# Altium project FMC_DAC_125M_14B_16CHA.PrjPCB (part 1 of 4)
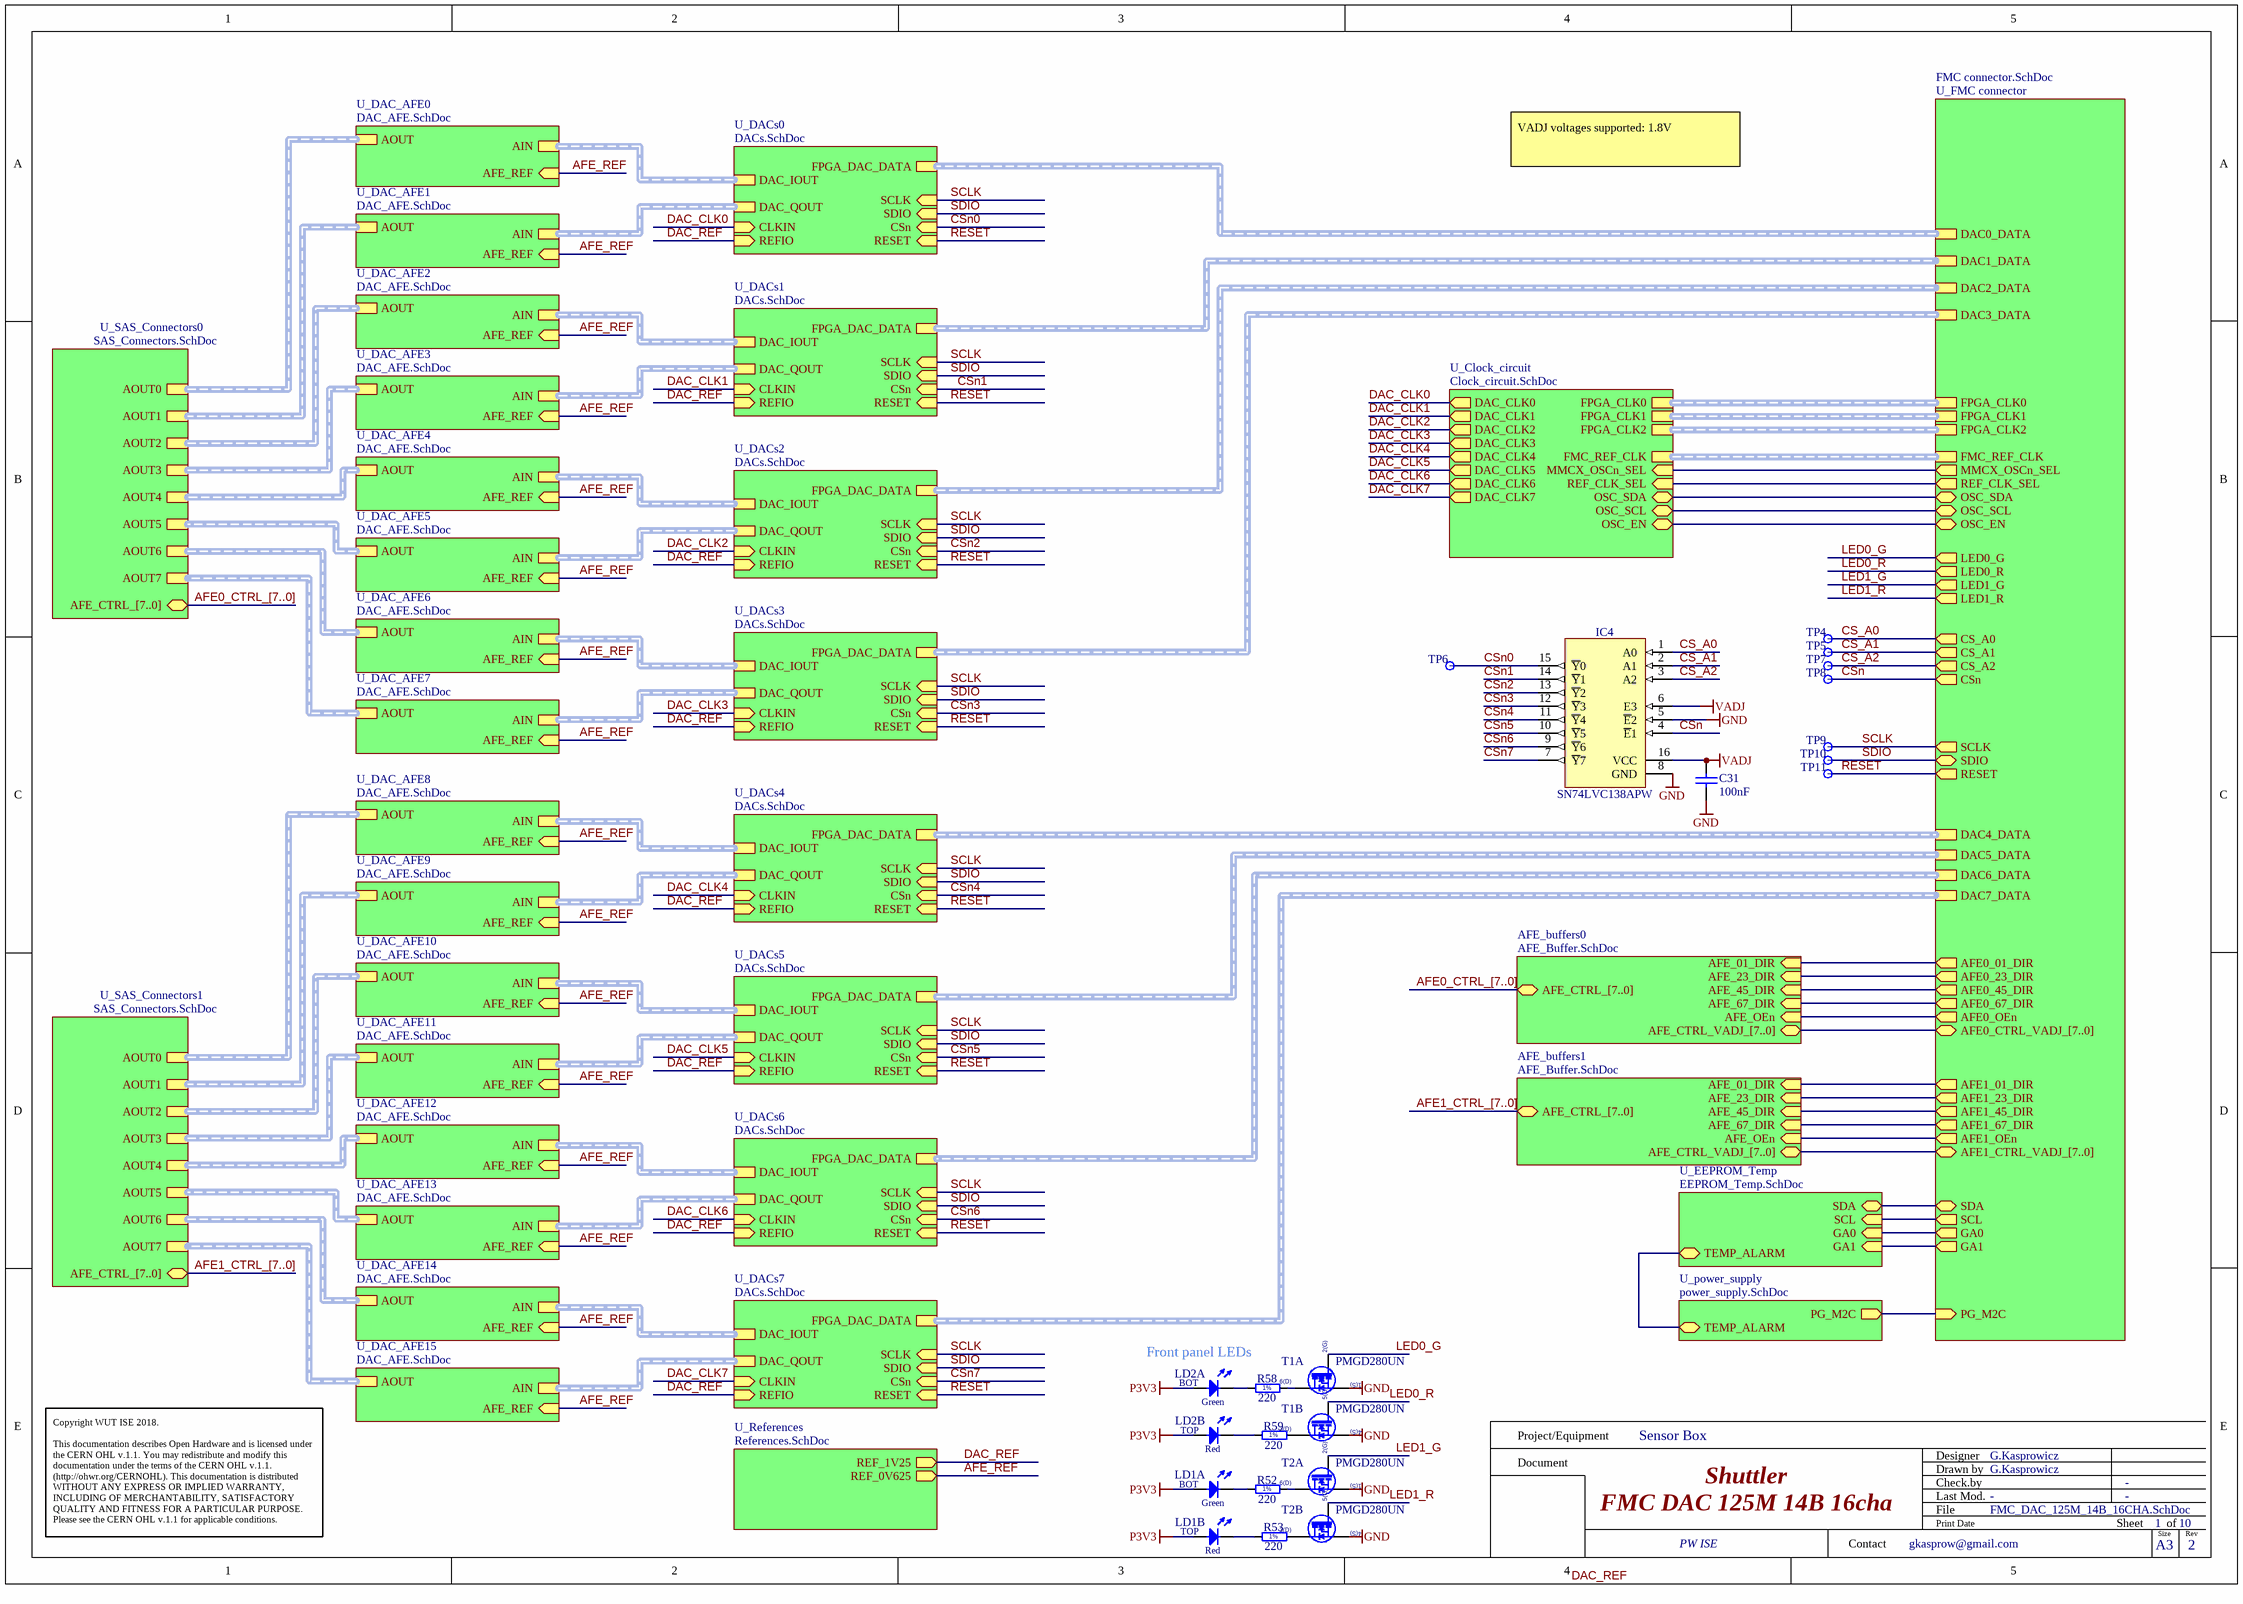
[diagram p0: FMC_DAC_125M_14B_16CHA.SchDoc]
P_version: 1.2
10 sheets, 614 parts. Net scope: hierarchical (ports join the sheet entries above them; power ports are global).
Board file: FMC_DAC_125M_14B_16CHA.PcbDoc
Sheets:
  FMC_DAC_125M_14B_16CHA.SchDoc
    U_EEPROM_Temp = EEPROM_Temp.SchDoc
    U_FMC connector = FMC connector.SchDoc
    U_power_supply = power_supply.SchDoc
    U_SAS_Connectors0 = SAS_Connectors.SchDoc
    U_DAC_AFE0 = DAC_AFE.SchDoc
    U_DAC_AFE1 = DAC_AFE.SchDoc
    U_DAC_AFE2 = DAC_AFE.SchDoc
    U_DAC_AFE3 = DAC_AFE.SchDoc
    U_DAC_AFE4 = DAC_AFE.SchDoc
    U_DAC_AFE5 = DAC_AFE.SchDoc
    U_DAC_AFE6 = DAC_AFE.SchDoc
    U_DAC_AFE7 = DAC_AFE.SchDoc
    U_DAC_AFE8 = DAC_AFE.SchDoc
    U_DAC_AFE9 = DAC_AFE.SchDoc
    U_DAC_AFE10 = DAC_AFE.SchDoc
    U_DAC_AFE11 = DAC_AFE.SchDoc
    U_DAC_AFE12 = DAC_AFE.SchDoc
    U_DAC_AFE13 = DAC_AFE.SchDoc
    U_DAC_AFE14 = DAC_AFE.SchDoc
    U_DAC_AFE15 = DAC_AFE.SchDoc
    U_SAS_Connectors1 = SAS_Connectors.SchDoc
    U_DACs0 = DACs.SchDoc
    U_DACs1 = DACs.SchDoc
    U_DACs2 = DACs.SchDoc
    U_DACs3 = DACs.SchDoc
    U_DACs4 = DACs.SchDoc
    U_DACs5 = DACs.SchDoc
    U_DACs6 = DACs.SchDoc
    U_DACs7 = DACs.SchDoc
    U_Clock_circuit = Clock_circuit.SchDoc
    AFE_buffers0 = AFE_Buffer.SchDoc
    AFE_buffers1 = AFE_Buffer.SchDoc
    U_References = References.SchDoc

## Sheet FMC_DAC_125M_14B_16CHA.SchDoc: Shuttler
size 420 x 297 mm; Author: G.Kasprowicz; CompanyName: WUT ISE; DrawnBy: G.Kasprowicz; Organization: WUT ISE; Address1: PW ISE; Address2: Nowowiejska 15/19 00-665 Warsaw; Address3: gkasprow@gmail.com; DocumentNumber: 1; Revision: 2; SheetNumber: 1; SheetTotal: 10; ModifiedBy: -; CheckedDate: -; Title2: FMC DAC 125M 14B 16cha; DivGrp: WUT ISE; Designer: G.Kasprowicz; ModifiedDate: -; ProjectName: Sensor Box

### Parts
C31  100nF  [CAPC1005X55N]
IC4  SN74LVC138APW  [SOP65P640X110-16N]
LD1  Red/Green  [LED_DIALIGHT_571-0112F]  (value not drawn)  (parts A,B of 2)
LD2  Red/Green  [LED_DIALIGHT_571-0112F]  (value not drawn)  (parts A,B of 2)
R52  220  [RESC1608X55N]
R53  220  [RESC1608X55N]
R58  220  [RESC1608X55N]
R59  220  [RESC1608X55N]
T1  PMGD280UN  [SOT65P210X110-6N]  (parts A,B of 2)
T2  PMGD280UN  [SOT65P210X110-6N]  (parts A,B of 2)
TP4  Test Point  [TPS127]  (value not drawn)
TP5  Test Point  [TPS127]  (value not drawn)
TP6  Test Point  [TPS127]  (value not drawn)
TP7  Test Point  [TPS127]  (value not drawn)
TP8  Test Point  [TPS127]  (value not drawn)
TP9  Test Point  [TPS127]  (value not drawn)
TP10  Test Point  [TPS127]  (value not drawn)
TP11  Test Point  [TPS127]  (value not drawn)

### Sub-sheets
AFE_buffers0 = AFE_Buffer.SchDoc: AFE_CTRL_[7..0] (bidir), AFE_23_DIR (in), AFE_67_DIR (in), AFE_01_DIR (in), AFE_OEn (in), AFE_45_DIR (in), AFE_CTRL_VADJ_[7..0] (bidir)
AFE_buffers1 = AFE_Buffer.SchDoc: AFE_CTRL_[7..0] (bidir), AFE_23_DIR (in), AFE_67_DIR (in), AFE_01_DIR (in), AFE_OEn (in), AFE_45_DIR (in), AFE_CTRL_VADJ_[7..0] (bidir)
U_Clock_circuit = Clock_circuit.SchDoc: FPGA_CLK0 (harness DIFFCLK), FPGA_CLK1 (harness DIFFCLK), FPGA_CLK2 (harness DIFFCLK), DAC_CLK0 (out), DAC_CLK1 (out), DAC_CLK2 (out), DAC_CLK3 (out), DAC_CLK4 (out), DAC_CLK5 (out), DAC_CLK6 (out), DAC_CLK7 (out), OSC_SDA (bidir), OSC_SCL (bidir), OSC_EN (bidir), MMCX_OSCn_SEL (in), FMC_REF_CLK (harness DIFFCLK), REF_CLK_SEL (in)
U_DAC_AFE0 = DAC_AFE.SchDoc: AIN (harness DIFF), AOUT (harness DIFF), AFE_REF (in)
U_DAC_AFE1 = DAC_AFE.SchDoc: AIN (harness DIFF), AOUT (harness DIFF), AFE_REF (in)
U_DAC_AFE2 = DAC_AFE.SchDoc: AIN (harness DIFF), AOUT (harness DIFF), AFE_REF (in)
U_DAC_AFE3 = DAC_AFE.SchDoc: AIN (harness DIFF), AOUT (harness DIFF), AFE_REF (in)
U_DAC_AFE4 = DAC_AFE.SchDoc: AIN (harness DIFF), AOUT (harness DIFF), AFE_REF (in)
U_DAC_AFE5 = DAC_AFE.SchDoc: AIN (harness DIFF), AOUT (harness DIFF), AFE_REF (in)
U_DAC_AFE6 = DAC_AFE.SchDoc: AIN (harness DIFF), AOUT (harness DIFF), AFE_REF (in)
U_DAC_AFE7 = DAC_AFE.SchDoc: AIN (harness DIFF), AOUT (harness DIFF), AFE_REF (in)
U_DAC_AFE8 = DAC_AFE.SchDoc: AIN (harness DIFF), AOUT (harness DIFF), AFE_REF (in)
U_DAC_AFE9 = DAC_AFE.SchDoc: AIN (harness DIFF), AOUT (harness DIFF), AFE_REF (in)
U_DAC_AFE10 = DAC_AFE.SchDoc: AIN (harness DIFF), AOUT (harness DIFF), AFE_REF (in)
U_DAC_AFE11 = DAC_AFE.SchDoc: AIN (harness DIFF), AOUT (harness DIFF), AFE_REF (in)
U_DAC_AFE12 = DAC_AFE.SchDoc: AIN (harness DIFF), AOUT (harness DIFF), AFE_REF (in)
U_DAC_AFE13 = DAC_AFE.SchDoc: AIN (harness DIFF), AOUT (harness DIFF), AFE_REF (in)
U_DAC_AFE14 = DAC_AFE.SchDoc: AIN (harness DIFF), AOUT (harness DIFF), AFE_REF (in)
U_DAC_AFE15 = DAC_AFE.SchDoc: AIN (harness DIFF), AOUT (harness DIFF), AFE_REF (in)
U_DACs0 = DACs.SchDoc: FPGA_DAC_DATA (harness DAC_DATA_E), SCLK (in), SDIO (in), CSn (in), RESET (in), DAC_IOUT (harness DIFF), DAC_QOUT (harness DIFF), CLKIN (in), REFIO (in)
U_DACs1 = DACs.SchDoc: FPGA_DAC_DATA (harness DAC_DATA_E), SCLK (in), SDIO (in), CSn (in), RESET (in), DAC_IOUT (harness DIFF), DAC_QOUT (harness DIFF), CLKIN (in), REFIO (in)
U_DACs2 = DACs.SchDoc: FPGA_DAC_DATA (harness DAC_DATA_E), SCLK (in), SDIO (in), CSn (in), RESET (in), DAC_IOUT (harness DIFF), DAC_QOUT (harness DIFF), CLKIN (in), REFIO (in)
U_DACs3 = DACs.SchDoc: FPGA_DAC_DATA (harness DAC_DATA_E), SCLK (in), SDIO (in), CSn (in), RESET (in), DAC_IOUT (harness DIFF), DAC_QOUT (harness DIFF), CLKIN (in), REFIO (in)
U_DACs4 = DACs.SchDoc: FPGA_DAC_DATA (harness DAC_DATA_E), SCLK (in), SDIO (in), CSn (in), RESET (in), DAC_IOUT (harness DIFF), DAC_QOUT (harness DIFF), CLKIN (in), REFIO (in)
U_DACs5 = DACs.SchDoc: FPGA_DAC_DATA (harness DAC_DATA_E), SCLK (in), SDIO (in), CSn (in), RESET (in), DAC_IOUT (harness DIFF), DAC_QOUT (harness DIFF), CLKIN (in), REFIO (in)
U_DACs6 = DACs.SchDoc: FPGA_DAC_DATA (harness DAC_DATA_E), SCLK (in), SDIO (in), CSn (in), RESET (in), DAC_IOUT (harness DIFF), DAC_QOUT (harness DIFF), CLKIN (in), REFIO (in)
U_DACs7 = DACs.SchDoc: FPGA_DAC_DATA (harness DAC_DATA_E), SCLK (in), SDIO (in), CSn (in), RESET (in), DAC_IOUT (harness DIFF), DAC_QOUT (harness DIFF), CLKIN (in), REFIO (in)
U_EEPROM_Temp = EEPROM_Temp.SchDoc: SDA (bidir), SCL (in), GA0 (in), GA1 (in), TEMP_ALARM (bidir)
U_FMC connector = FMC connector.SchDoc: SDA (bidir), GA1 (out), GA0 (out), SCL (out), CS_A2 (out), CSn (out), CS_A0 (out), CS_A1 (out), SCLK (out), SDIO (bidir), RESET (out), DAC4_DATA (harness DAC_DATA_E), DAC5_DATA (harness DAC_DATA_E), DAC6_DATA (harness DAC_DATA_E), DAC7_DATA (harness DAC_DATA_E), DAC1_DATA (harness DAC_DATA_E), DAC2_DATA (harness DAC_DATA_E), DAC3_DATA (harness DAC_DATA_E), DAC0_DATA (harness DAC_DATA_E), FPGA_CLK0 (harness DIFF), FPGA_CLK1 (harness DIFF), FPGA_CLK2 (harness DIFF), FMC_REF_CLK (harness DIFF), MMCX_OSCn_SEL (out), REF_CLK_SEL (out), OSC_SDA (bidir), OSC_SCL (bidir), OSC_EN (bidir), AFE0_01_DIR (out), AFE0_23_DIR (out), AFE0_45_DIR (out), AFE0_67_DIR (out), AFE0_OEn (out), AFE0_CTRL_VADJ_[7..0] (bidir), AFE1_CTRL_VADJ_[7..0] (bidir), AFE1_01_DIR (out), AFE1_23_DIR (out), AFE1_45_DIR (out), AFE1_67_DIR (out), AFE1_OEn (out), PG_M2C (in), LED0_G (out), LED0_R (out), LED1_G (out), LED1_R (out)
U_power_supply = power_supply.SchDoc: PG_M2C (out), TEMP_ALARM (bidir)
U_References = References.SchDoc: REF_1V25 (out), REF_0V625 (out)
U_SAS_Connectors0 = SAS_Connectors.SchDoc: AOUT4 (harness DIFF), AOUT0 (harness DIFF), AOUT1 (harness DIFF), AOUT2 (harness DIFF), AOUT6 (harness DIFF), AOUT7 (harness DIFF), AFE_CTRL_[7..0] (bidir), AOUT3 (harness DIFF), AOUT5 (harness DIFF)
U_SAS_Connectors1 = SAS_Connectors.SchDoc: AOUT4 (harness DIFF), AOUT0 (harness DIFF), AOUT1 (harness DIFF), AOUT2 (harness DIFF), AOUT6 (harness DIFF), AOUT7 (harness DIFF), AOUT3 (harness DIFF), AOUT5 (harness DIFF), AFE_CTRL_[7..0] (bidir)

### Nets
GND: C31.1 IC4.5(~{E}2) IC4.8(GND) T1.1(S) T1.4(S) T2.1(S) T2.4(S)
P3V3: LD1.2(A) LD1.4(A) LD2.2(A) LD2.4(A)
VADJ: C31.2 IC4.6(E3) IC4.16(VCC)
AFE_REF: sheet U_DAC_AFE0/AFE_REF, sheet U_DAC_AFE1/AFE_REF, sheet U_DAC_AFE2/AFE_REF, sheet U_DAC_AFE3/AFE_REF, sheet U_DAC_AFE4/AFE_REF, sheet U_DAC_AFE5/AFE_REF, sheet U_DAC_AFE6/AFE_REF, sheet U_DAC_AFE7/AFE_REF, sheet U_DAC_AFE8/AFE_REF, sheet U_DAC_AFE9/AFE_REF, sheet U_DAC_AFE10/AFE_REF, sheet U_DAC_AFE11/AFE_REF, sheet U_DAC_AFE12/AFE_REF, sheet U_DAC_AFE13/AFE_REF, sheet U_DAC_AFE14/AFE_REF, sheet U_DAC_AFE15/AFE_REF, sheet U_References/REF_0V625
CS_A0: IC4.1(A0) TP4.1 ; sheet U_FMC connector/CS_A0
CS_A1: IC4.2(A1) TP5.1 ; sheet U_FMC connector/CS_A1
CS_A2: IC4.3(A2) TP7.1 ; sheet U_FMC connector/CS_A2
CSn: IC4.4(~{E}1) TP8.1 ; sheet U_FMC connector/CSn
CSn0: IC4.15(~{Y}0) TP6.1 ; sheet U_DACs0/CSn
CSn1: IC4.14(~{Y}1) ; sheet U_DACs1/CSn  [project net CSn0]
CSn2: IC4.13(~{Y}2) ; sheet U_DACs2/CSn  [project net CSn0]
CSn3: IC4.12(~{Y}3) ; sheet U_DACs3/CSn  [project net CSn0]
CSn4: IC4.11(~{Y}4) ; sheet U_DACs4/CSn  [project net CSn0]
CSn5: IC4.10(~{Y}5) ; sheet U_DACs5/CSn  [project net CSn0]
CSn6: IC4.9(~{Y}6) ; sheet U_DACs6/CSn  [project net CSn0]
CSn7: IC4.7(~{Y}7) ; sheet U_DACs7/CSn  [project net CSn0]
DAC_CLK0: sheet U_DACs0/CLKIN, sheet U_Clock_circuit/DAC_CLK0
DAC_CLK1: sheet U_DACs1/CLKIN, sheet U_Clock_circuit/DAC_CLK1
DAC_CLK2: sheet U_DACs2/CLKIN, sheet U_Clock_circuit/DAC_CLK2
DAC_CLK3: sheet U_DACs3/CLKIN, sheet U_Clock_circuit/DAC_CLK3
DAC_CLK4: sheet U_DACs4/CLKIN, sheet U_Clock_circuit/DAC_CLK4
DAC_CLK5: sheet U_DACs5/CLKIN, sheet U_Clock_circuit/DAC_CLK5
DAC_CLK6: sheet U_DACs6/CLKIN, sheet U_Clock_circuit/DAC_CLK6
DAC_CLK7: sheet U_DACs7/CLKIN, sheet U_Clock_circuit/DAC_CLK7
DAC_REF: sheet U_DACs0/REFIO, sheet U_DACs1/REFIO, sheet U_DACs2/REFIO, sheet U_DACs3/REFIO, sheet U_DACs4/REFIO, sheet U_DACs5/REFIO, sheet U_DACs6/REFIO, sheet U_DACs7/REFIO, sheet U_References/REF_1V25
GA0: sheet U_EEPROM_Temp/GA0, sheet U_FMC connector/GA0
GA1: sheet U_EEPROM_Temp/GA1, sheet U_FMC connector/GA1
HA17_CC_N: sheet U_FMC connector/AFE0_67_DIR, sheet U_FMC connector/AFE1_67_DIR, sheet AFE_buffers0/AFE_67_DIR, sheet AFE_buffers1/AFE_67_DIR
HB00_CC_N: sheet U_FMC connector/AFE0_23_DIR, sheet U_FMC connector/AFE1_23_DIR, sheet AFE_buffers0/AFE_23_DIR, sheet AFE_buffers1/AFE_23_DIR
HB17_CC_N: sheet U_FMC connector/MMCX_OSCn_SEL, sheet U_Clock_circuit/MMCX_OSCn_SEL
HB17_CC_P: sheet U_FMC connector/AFE0_45_DIR, sheet U_FMC connector/AFE1_45_DIR, sheet AFE_buffers0/AFE_45_DIR, sheet AFE_buffers1/AFE_45_DIR
HB19_N: sheet U_FMC connector/AFE0_OEn, sheet U_FMC connector/AFE1_OEn, sheet AFE_buffers0/AFE_OEn, sheet AFE_buffers1/AFE_OEn
HB20_N: sheet U_FMC connector/OSC_EN, sheet U_Clock_circuit/OSC_EN
HB20_P: sheet U_FMC connector/OSC_SDA, sheet U_Clock_circuit/OSC_SDA
HB21_N: sheet U_FMC connector/OSC_SCL, sheet U_Clock_circuit/OSC_SCL
LA26_N: sheet U_FMC connector/AFE0_01_DIR, sheet U_FMC connector/AFE1_01_DIR, sheet AFE_buffers0/AFE_01_DIR, sheet AFE_buffers1/AFE_01_DIR
LA32_N: sheet U_FMC connector/REF_CLK_SEL, sheet U_Clock_circuit/REF_CLK_SEL
LED0_G: T1.2(G) ; sheet U_FMC connector/LED0_G  [project net HA23_N]
LED0_R: T1.5(G) ; sheet U_FMC connector/LED0_R  [project net HA23_P]
LED1_G: T2.2(G) ; sheet U_FMC connector/LED1_G  [project net LA32_P]
LED1_R: T2.5(G) ; sheet U_FMC connector/LED1_R  [project net HB18_N]
PG_M2C: sheet U_FMC connector/PG_M2C, sheet U_power_supply/PG_M2C
RESET: TP11.1 ; sheet U_FMC connector/RESET, sheet U_DACs0/RESET, sheet U_DACs1/RESET, sheet U_DACs2/RESET, sheet U_DACs3/RESET, sheet U_DACs4/RESET, sheet U_DACs5/RESET, sheet U_DACs6/RESET, sheet U_DACs7/RESET  [project net HB16_P]
SCL: sheet U_EEPROM_Temp/SCL, sheet U_FMC connector/SCL
SCLK: TP9.1 ; sheet U_FMC connector/SCLK, sheet U_DACs0/SCLK, sheet U_DACs1/SCLK, sheet U_DACs2/SCLK, sheet U_DACs3/SCLK, sheet U_DACs4/SCLK, sheet U_DACs5/SCLK, sheet U_DACs6/SCLK, sheet U_DACs7/SCLK  [project net HB16_N]
SDA: sheet U_EEPROM_Temp/SDA, sheet U_FMC connector/SDA
SDIO: TP10.1 ; sheet U_FMC connector/SDIO, sheet U_DACs0/SDIO, sheet U_DACs1/SDIO, sheet U_DACs2/SDIO, sheet U_DACs3/SDIO, sheet U_DACs4/SDIO, sheet U_DACs5/SDIO, sheet U_DACs6/SDIO, sheet U_DACs7/SDIO  [project net HB06_CC_N]
TEMP_ALARM: sheet U_EEPROM_Temp/TEMP_ALARM, sheet U_power_supply/TEMP_ALARM
NetLD1_1: LD1.1(C) R52.1
NetLD1_3: LD1.3(C) R53.1
NetLD2_1: LD2.1(C) R58.1
NetLD2_3: LD2.3(C) R59.1
NetR52_2: R52.2 T2.6(D)
NetR53_2: R53.2 T2.3(D)
NetR58_2: R58.2 T1.6(D)
NetR59_2: R59.2 T1.3(D)

### Buses and harness runs
bus AFE0_CTRL_[7..0] = sheet AFE_buffers0/AFE_CTRL_[7..0]
bus AFE0_CTRL_[7..0] = sheet U_SAS_Connectors0/AFE_CTRL_[7..0]
bus AFE1_CTRL_[7..0] = sheet AFE_buffers1/AFE_CTRL_[7..0]
bus AFE1_CTRL_[7..0] = sheet U_SAS_Connectors1/AFE_CTRL_[7..0]
bus sheet AFE_buffers0/AFE_CTRL_VADJ_[7..0] = sheet U_FMC connector/AFE0_CTRL_VADJ_[7..0]
bus sheet AFE_buffers1/AFE_CTRL_VADJ_[7..0] = sheet U_FMC connector/AFE1_CTRL_VADJ_[7..0]
harness sheet U_Clock_circuit/FMC_REF_CLK = sheet U_FMC connector/FMC_REF_CLK
harness sheet U_Clock_circuit/FPGA_CLK0 = sheet U_FMC connector/FPGA_CLK0
harness sheet U_Clock_circuit/FPGA_CLK1 = sheet U_FMC connector/FPGA_CLK1
harness sheet U_Clock_circuit/FPGA_CLK2 = sheet U_FMC connector/FPGA_CLK2
harness sheet U_DAC_AFE0/AIN = sheet U_DACs0/DAC_IOUT
harness sheet U_DAC_AFE0/AOUT = sheet U_SAS_Connectors0/AOUT0
harness sheet U_DAC_AFE1/AIN = sheet U_DACs0/DAC_QOUT
harness sheet U_DAC_AFE1/AOUT = sheet U_SAS_Connectors0/AOUT1
harness sheet U_DAC_AFE2/AIN = sheet U_DACs1/DAC_IOUT
harness sheet U_DAC_AFE2/AOUT = sheet U_SAS_Connectors0/AOUT2
harness sheet U_DAC_AFE3/AIN = sheet U_DACs1/DAC_QOUT
harness sheet U_DAC_AFE3/AOUT = sheet U_SAS_Connectors0/AOUT3
harness sheet U_DAC_AFE4/AIN = sheet U_DACs2/DAC_IOUT
harness sheet U_DAC_AFE4/AOUT = sheet U_SAS_Connectors0/AOUT4
harness sheet U_DAC_AFE5/AIN = sheet U_DACs2/DAC_QOUT
harness sheet U_DAC_AFE5/AOUT = sheet U_SAS_Connectors0/AOUT5
harness sheet U_DAC_AFE6/AIN = sheet U_DACs3/DAC_IOUT
harness sheet U_DAC_AFE6/AOUT = sheet U_SAS_Connectors0/AOUT6
harness sheet U_DAC_AFE7/AIN = sheet U_DACs3/DAC_QOUT
harness sheet U_DAC_AFE7/AOUT = sheet U_SAS_Connectors0/AOUT7
harness sheet U_DAC_AFE8/AIN = sheet U_DACs4/DAC_IOUT
harness sheet U_DAC_AFE8/AOUT = sheet U_SAS_Connectors1/AOUT0
harness sheet U_DAC_AFE9/AIN = sheet U_DACs4/DAC_QOUT
harness sheet U_DAC_AFE9/AOUT = sheet U_SAS_Connectors1/AOUT1
harness sheet U_DAC_AFE10/AIN = sheet U_DACs5/DAC_IOUT
harness sheet U_DAC_AFE10/AOUT = sheet U_SAS_Connectors1/AOUT2
harness sheet U_DAC_AFE11/AIN = sheet U_DACs5/DAC_QOUT
harness sheet U_DAC_AFE11/AOUT = sheet U_SAS_Connectors1/AOUT3
harness sheet U_DAC_AFE12/AIN = sheet U_DACs6/DAC_IOUT
harness sheet U_DAC_AFE12/AOUT = sheet U_SAS_Connectors1/AOUT4
harness sheet U_DAC_AFE13/AIN = sheet U_DACs6/DAC_QOUT
harness sheet U_DAC_AFE13/AOUT = sheet U_SAS_Connectors1/AOUT5
harness sheet U_DAC_AFE14/AIN = sheet U_DACs7/DAC_IOUT
harness sheet U_DAC_AFE14/AOUT = sheet U_SAS_Connectors1/AOUT6
harness sheet U_DAC_AFE15/AIN = sheet U_DACs7/DAC_QOUT
harness sheet U_DAC_AFE15/AOUT = sheet U_SAS_Connectors1/AOUT7
harness sheet U_DACs0/FPGA_DAC_DATA = sheet U_FMC connector/DAC0_DATA
harness sheet U_DACs1/FPGA_DAC_DATA = sheet U_FMC connector/DAC1_DATA
harness sheet U_DACs2/FPGA_DAC_DATA = sheet U_FMC connector/DAC2_DATA
harness sheet U_DACs3/FPGA_DAC_DATA = sheet U_FMC connector/DAC3_DATA
harness sheet U_DACs4/FPGA_DAC_DATA = sheet U_FMC connector/DAC4_DATA
harness sheet U_DACs5/FPGA_DAC_DATA = sheet U_FMC connector/DAC5_DATA
harness sheet U_DACs6/FPGA_DAC_DATA = sheet U_FMC connector/DAC6_DATA
harness sheet U_DACs7/FPGA_DAC_DATA = sheet U_FMC connector/DAC7_DATA

### Notes on the sheet
- VADJ voltages supported: 1.8V
- Front panel LEDs
- Labels drawn without touching a wire or pin: DAC_REF
- Project/Equipment
- Document
- Designer
- Drawn by
- Check.by
- Copyright WUT ISE 2018.
  This documentation describes Open Hardware and is licensed under the CERN OHL v.1.1. You may redistribute and modify this documentation under the terms of the CERN OHL v.1.1. (http://ohwr.org/CERNOHL). This documentation is distributed WITHOUT ANY EXPRESS OR IMPLIED WARRANTY, INCLUDING OF MERCHANTABILITY, SATISFACTORY QUALITY AND FITNESS FOR A PARTICULAR PURPOSE. Please see the CERN OHL v.1.1 for applicable conditions.
- Contact
- File
- Last Mod.
- Print Date
- Sheet
- Size
- A3
- of
- Rev
- (in symbol LED_DIALIGHT_571-0112F, part A) BOT; Green
- (in symbol LED_DIALIGHT_571-0112F, part B) TOP; Red
- (in symbol PMGD280UN, part A) 2(G); 1(S); 6(D)
- (in symbol PMGD280UN, part B) 5(G); 4(S); 3(D)
- (in symbol R0603_220R_1%_0.1W_100PPM) 1%

### Library data of the parts
C31 = CC0402_100NF_16V_10%_X5R: Non-polarised capacitor; Part Description: SMD Multilayer Chip Ceramic Capacitor; Manufacturer: GENERIC; Manufacturer1 Part Number: GRM155R61C104KA88D; Voltage: 16V; TC: X5R; Tolerance: ±10%; Part Number: CC0402_100NF_16V_10%_X5R; Component Kind: Standard; Component Type: Standard; Pin Count: 2; Value: 100nF; Status: None; Manufacturer Part Number: CC0402_100NF_16V_10%_X5R; Case: 0402; Mounted: Yes; Socket: No; SMD: Yes; Sense: No; Manufacturer1 Example: MURATA; Manufacturer1 ComponentHeight: 0.55mm; HelpURL: \\cern.ch\dfs\Applications\Altium\Datasheets\CC0402_X5R_MURATA_GRM.pdf; Author: CERN DEM JLC; CreateDate: 10.12.2013; LatestRevisionDate: 10.12.2013
IC4 = SN74LVC138APW: 3-Line to 8-Line Decoder/Demultiplexer; Part Description: 3-Line to 8-Line Decoder/Demultiplexer, Inverting; Manufacturer: Texas Instruments; PressFit: No; Bonding: No; Part Number: SN74LVC138APW; Component Kind: Standard; Component Type: Standard; Device: SN74LVC138APW; PackageDescription: SOP, 0.65mm pitch; 16 pin, 4.40mm W X 5.00mm L X 1.10mm H body IPC Medium Density; Manufacturer Part Number: SN74LVC138APW; Pin Count: 16; Case: TSSOP16; Mounted: Yes; Socket: No; SMD: Yes; Sense: No; ComponentHeight: 1.1mm; Author: GK; HelpURL: \\cern.ch\dfs\Applications\Altium\Datasheets\74HC138PW.pdf; CreateDate: 09/06/2015; LatestRevisionDate: 09/06/2015
LD1 LD2 = LED_DIALIGHT_571-0112F: 2x LED  Botom Green, Top Red; Part Description: Dual 2mm  LEDs, Red Top,Green Bot, CBI® Circuit Board Indicator (Without positioning pins); PressFit: No; Bonding: No; Part Number: LED_DIALIGHT_571-0112F; Component Kind: Standard; Component Type: Standard; Color: Red/Green; PackageDescription: 2x 2mm LED (Top: Red, Bot: Green) PCB Edge Mounting (Without positioning pins) DIALIGHT 571 Serie; Manufacturer: DIALIGHT; Manufacturer Part Number: 571-0112F; Pin Count: 4; Mounted: Yes; Socket: No; SMD: No; Sense: No; ComponentHeight: 8.6mm; HelpURL: \\cern.ch\dfs\Applications\Altium\Datasheets\LED_DIALIGHT_571-0112F.pdf; Author: CERN DEM JLC; CreateDate: 09/11/2009; LatestRevisionDate: 17/03/2010
R52 R53 R58 R59 = R0603_220R_1%_0.1W_100PPM: Resistor - 1%; Part Description: General Purpose Thick Film Chip Resistor; Manufacturer: GENERIC; Manufacturer1 Part Number: NRC06F2200TRF; Power: 0.1W; TC: ±100ppm/°C; Part Number: R0603_220R_1%_0.1W_100PPM; Component Kind: Standard; Component Type: Standard; Pin Count: 2; Value: 220; Status: Preferred; Tolerance: ±1%; Manufacturer Part Number: R0603_220R_1%_0.1W_100PPM; Case: 0603; Mounted: Yes; Sense: No; Socket: No; SMD: Yes; Manufacturer1 Example: NIC COMPONENT; Manufacturer1 ComponentHeight: 0.55mm; HelpURL: \\cern.ch\dfs\Applications\Altium\Datasheets\R0603_NIC_NRC.pdf; Author: CERN DEM JLC; CreateDate: 03.12.2007; LatestRevisionDate: 13.03.2008
T1 T2 = PMGD280UN: Dual N-Channel micro TrenchMOS™ Ultra Low Level FET; Part Description: 20V 870mA Dual N-Channel micro TrenchMOS™ Ultra Low Level FET; Manufacturer: NXP SEMICONDUCTORS; PressFit: No; Bonding: No; Part Number: PMGD280UN; Component Kind: Standard; Component Type: Standard; Device: PMGD280UN; PackageDescription: SOT363, SC70-6, SOT, 0.65mm Pitch, 6 pin, 1.25mm W X 2.00mm L X 1.10mm H, IPC Medium Density; Manufacturer Part Number: PMGD280UN; Pin Count: 6; Case: SOT363; Mounted: Yes; Socket: No; SMD: Yes; Sense: No; ComponentHeight: 1.1mm; HelpURL: \\cern.ch\dfs\Applications\Altium\Datasheets\PMGD280UN.pdf; Author: CERN DEM JLC; CreateDate: 19/11/2014; LatestRevisionDate: 19/11/2014
TP4-TP11 = SMD_PAD_1.27X1.27MM: Part Description: 1.27mm x 1.27mm PCB Copper Area (SMD Test Point); Mounted: No; Part Number: SMD_PAD_1.27X1.27MM; Component Kind: Standard (No BOM); Component Type: Standard (No BOM); Pin Count: 1; Family: Test Point; Socket: No; SMD: Yes; Sense: No; Status: None; ComponentHeight: 0mm; HelpURL: Undefined; Author: CERN DEM JLC; CreateDate: 12.01.2008; LatestRevisionDate: 12.01.2008; PackageDescription: 1.27mm x 1.27mm PCB Copper Area (SMD Test Point)

## Sheet EEPROM_Temp.SchDoc: Shuttler
size 420 x 297 mm; Author: G.Kasprowicz; CompanyName: WUT ISE; DrawnBy: G.Kasprowicz; Organization: WUT ISE; Address1: PW ISE; Address2: Nowowiejska 15/19 00-665 Warsaw; Address3: gkasprow@gmail.com; DocumentNumber: 8; Revision: 2; SheetNumber: 8; SheetTotal: 10; ModifiedBy: -; CheckedDate: -; Title2: EEPROM, temperature sensor; DivGrp: WUT ISE; Designer: G.Kasprowicz; ModifiedDate: -; ProjectName: Sensor Box
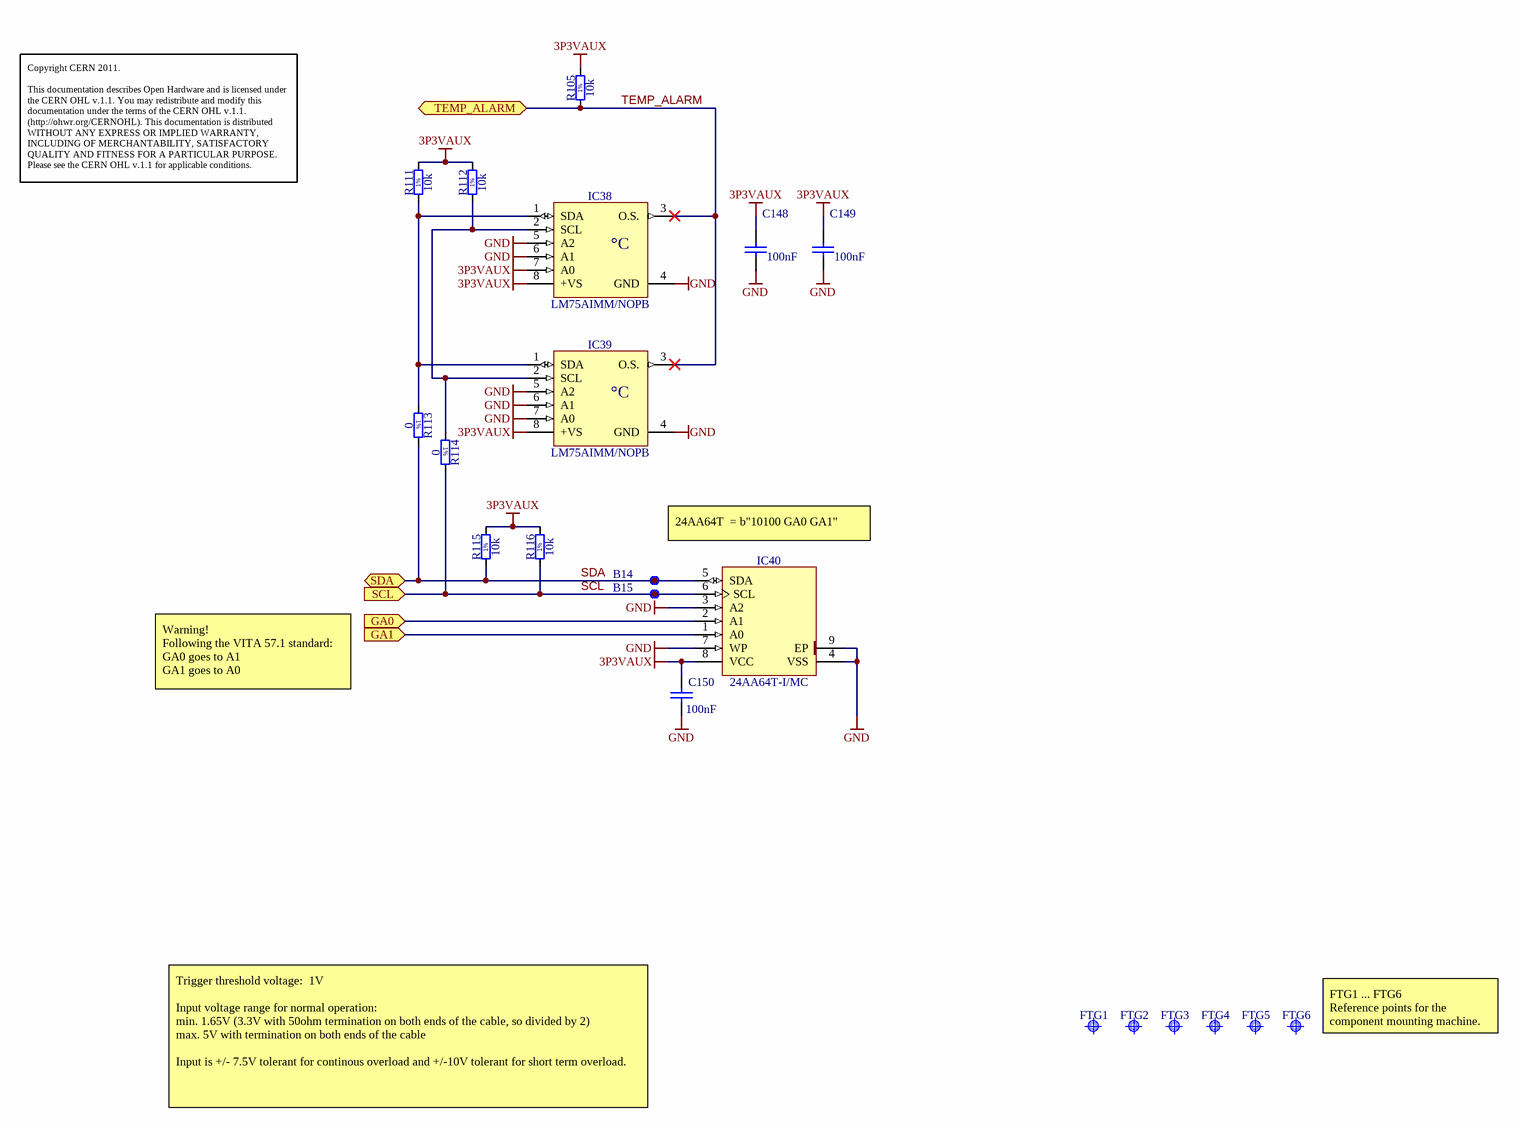
[diagram p1: EEPROM_Temp.SchDoc]

### Parts
B14  SMD Pad  [C100]  (value not drawn)
B15  SMD Pad  [C100]  (value not drawn)
C148  100nF  [CAPC0603X33N]
C149  100nF  [CAPC0603X33N]
C150  100nF  [CAPC0603X33N]
FTG1  Use only in PCB  [FIDUCIAL_TOP_S100-200]  (value not drawn)
FTG2  Use only in PCB  [FIDUCIAL_TOP_S100-200]  (value not drawn)
FTG3  Use only in PCB  [FIDUCIAL_TOP_S100-200]  (value not drawn)
FTG4  Use only in PCB  [FIDUCIAL_TOP_S100-200]  (value not drawn)
FTG5  Use only in PCB  [FIDUCIAL_TOP_S100-200]  (value not drawn)
FTG6  Use only in PCB  [FIDUCIAL_TOP_S100-200]  (value not drawn)
IC38  LM75AIMM/NOPB  [SOP65P490X109-8N]
IC39  LM75AIMM/NOPB  [SOP65P490X109-8N]
IC40  24AA64T-I/MC  [SON50P300X200X100-9N-S175X155]
R105  10k  [RESC1005X40N]
R111  10k  [RESC1005X40N]
R112  10k  [RESC1005X40N]
R113  0  [RESC1005X40N]
R114  0  [RESC1005X40N]
R115  10k  [RESC1005X40N]
R116  10k  [RESC1005X40N]

### Ports
GA0 (in), GA1 (in), SCL (in), SDA (bidir), TEMP_ALARM (bidir)

### Nets
3P3VAUX: C148.1 C149.1 C150.1 IC38.7(A0) IC38.8(+VS) IC39.8(+VS) IC40.8(VCC) R105.2 R111.2 R112.2 R115.2 R116.2
GND: C148.2 C149.2 C150.2 IC38.4(GND) IC38.5(A2) IC38.6(A1) IC39.4(GND) IC39.5(A2) IC39.6(A1) IC39.7(A0) IC40.3(A2) IC40.4(VSS) IC40.7(WP) IC40.9(EP)
GA0: IC40.2(A1) ; port GA0
GA1: IC40.1(A0) ; port GA1
SCL: B15.1 IC40.6(SCL) R114.2 R116.1 ; port SCL
SDA: B14.1 IC40.5(SDA) R113.2 R115.1 ; port SDA
TEMP_ALARM: IC38.3(O.S.) IC39.3(O.S.) R105.1 ; port TEMP_ALARM
NetIC38_1: IC38.1(SDA) IC39.1(SDA) R111.1 R113.1
NetIC38_2: IC38.2(SCL) IC39.2(SCL) R112.1 R114.1

### Notes on the sheet
- Copyright CERN 2011.
  This documentation describes Open Hardware and is licensed under the CERN OHL v.1.1. You may redistribute and modify this documentation under the terms of the CERN OHL v.1.1. (http://ohwr.org/CERNOHL). This documentation is distributed WITHOUT ANY EXPRESS OR IMPLIED WARRANTY, INCLUDING OF MERCHANTABILITY, SATISFACTORY QUALITY AND FITNESS FOR A PARTICULAR PURPOSE. Please see the CERN OHL v.1.1 for applicable conditions.
- 24AA64T  = b"10100 GA0 GA1"
- Warning!
  Following the VITA 57.1 standard:
  GA0 goes to A1
  GA1 goes to A0
- (near FTG6) FTG1 ... FTG6
  Reference points for the component mounting machine.
- Trigger threshold voltage:  1V
  Input voltage range for normal operation:
  min. 1.65V (3.3V with 50ohm termination on both ends of the cable, so divided by 2)
  max. 5V with termination on both ends of the cable
  Input is +/- 7.5V tolerant for continous overload and +/-10V tolerant for short term overload.
- Project/Equipment
- Document
- Designer
- Drawn by
- Check.by
- Copyright WUT ISE 2018.
  This documentation describes Open Hardware and is licensed under the CERN OHL v.1.1. You may redistribute and modify this documentation under the terms of the CERN OHL v.1.1. (http://ohwr.org/CERNOHL). This documentation is distributed WITHOUT ANY EXPRESS OR IMPLIED WARRANTY, INCLUDING OF MERCHANTABILITY, SATISFACTORY QUALITY AND FITNESS FOR A PARTICULAR PURPOSE. Please see the CERN OHL v.1.1 for applicable conditions.
- Contact
- File
- Last Mod.
- Print Date
- Sheet
- Size
- A3
- of
- Rev
- (in symbol LM75AIMM/NOPB) °C
- (in symbol R0402_0R_JUMPER) 1%
- (in symbol R0402_10K_1%_0.0625W_100PPM) 1%

### Library data of the parts
B14 B15 = SMD_PAD_D1MM: Through Hole Pad; Part Description: 1mm Diameter SMD Pad; Mounted: No; Part Number: SMD_PAD_D1MM; Component Kind: Standard (No BOM); Component Type: Standard (No BOM); Pin Count: 1; Family: SMD Pad; Socket: No; SMD: No; Sense: No; Status: None; ComponentHeight: 0mm; HelpURL: Undefined; Author: CERN DEM JLC; CreateDate: 10.10.2017; LatestRevisionDate: 10.10.2017; PackageDescription: 1mm Diameter SMD Pad
C148-C150 = CC0201_100NF_6.3V_10%_X5R: Non-polarised capacitor; Part Description: SMD Multilayer Chip Ceramic Capacitor; Manufacturer: GENERIC; Manufacturer1 Part Number: 02016D104KAT2A; Voltage: 6.3V; TC: X5R; Tolerance: ±10%; Table: Capacitors SMD; Part Number: CC0201_100NF_6.3V_10%_X5R; Component Kind: Standard; Component Type: Standard; Pin Count: 2; Value: 100nF; Status: Not Recommended; Manufacturer Part Number: CC0201_100NF_6.3V_10%_X5R; Case: 0201; Mounted: Yes; Socket: No; SMD: Yes; Manufacturer1 Example: AVX; Manufacturer1 ComponentHeight: 0.33mm; HelpURL: \\cern.ch\dfs\Applications\Altium\Datasheets\CC0201_X5R_AVX.pdf; Author: CERN DEM JLC; CreateDate: 2007-12-03; LatestRevisionDate: 2007-12-03
FTG1-FTG6 = FIDUCIAL_TARGET_S100-200: Fiducial Target; Part Description: Square Fiducial Target, Top Layer, 1.0mm, Top Solder 2.0mm, Keepout =2.0mm; Mounted: No; Table: Pads; Part Number: FIDUCIAL_TARGET_S100-200; Component Kind: Standard (No BOM); Component Type: Standard (No BOM); Pin Count: 1; Family: Fiducial; Socket: No; SMD: Yes; Status: None; ComponentHeight: 0mm; Author: CERN DEM JLC; CreateDate: 9/2/2010; LatestRevisionDate: 4/4/2012; PackageDescription: Square Fiducial Target, Top Layer, 1.0mm, Top Solder 2.0mm, Keepout =2.0mm
IC38 IC39 = LM75AIMM/NOPB: Digital Temperature Sensor and Thermal Watchdog with Two-Wire Interface; Part Description: -25° to +100°C ±2°C Digital Temperature Sensor and Thermal Watchdog with Two-Wire Interface; Manufacturer: TEXAS INSTRUMENTS; Table: Sensors; Part Number: LM75AIMM/NOPB; Component Kind: Standard; Component Type: Standard; Device: LM75AIMM/NOPB; PackageDescription: SOP, 0.65mm pitch; 8 pin,3.00mm W X 3.00mm L X 1.09mm H bodyI, PC Medium Density; Manufacturer Part Number: LM75AIMM/NOPB; Pin Count: 8; Case: SSOP8; Mounted: Yes; Socket: No; SMD: Yes; ComponentHeight: 1.09mm; HelpURL: \\cern.ch\dfs\Applications\Altium\Datasheets\LM75AIMM-NOPB.pdf; Author: CERN DEM JLC; CreateDate: 2012-10-15; LatestRevisionDate: 2012-10-15
IC40 = 24AA64T-I/MC: 1.7-5.5V 64K I2C Serial EEPROM; Part Description: 1.7V-5.5V, 64K  (8K x 8-bit) I2C Serial EEPROM; Manufacturer: MICROCHIP TECHNOLOGY; Table: Logic; Part Number: 24AA64T-I/MC; Component Kind: Standard; Component Type: Standard; Device: 24AA64T-I/MC; PackageDescription: SON (DFN), 0.50mm pitch, 8 pin, 2mm X 3mm X 1.00mm H body (w/thermal tab 1.75 X 1.55mm),  IPC Medium Density; Manufacturer Part Number: 24AA64T-I/MC; Pin Count: 9; Case: DFN8; Mounted: Yes; Socket: No; SMD: Yes; ComponentHeight: 1.0mm; HelpURL: \\cern.ch\dfs\Applications\Altium\Datasheets\24AA64T-I-MC.pdf; Author: CERN DEM JLC; CreateDate: 18/11/2009; LatestRevisionDate: 24/1/2011
R105 R111 R112 R115 R116 = R0402_10K_1%_0.0625W_100PPM: Resistor - 1%; Part Description: General Purpose Thick Film Chip Resistor; Manufacturer: GENERIC; Manufacturer1 Part Number: 232270671003L; TC: ±100ppm/°C; Table: Resistors SMD; Part Number: R0402_10K_1%_0.0625W_100PPM; Component Kind: Standard; Component Type: Standard; Pin Count: 2; Value: 10k; Status: Not recommended; Power: 0.0625W; Tolerance: ±1%; Manufacturer Part Number: R0402_10K_1%_0.0625W_100PPM; Case: 0402; Mounted: Yes; Socket: No; SMD: Yes; Manufacturer1 Example: YAGEO PHYCOMP; Manufacturer1 ComponentHeight: 0.4mm; HelpURL: \\cern.ch\dfs\Applications\Altium\Datasheets\R0402_Phycomp_RC0402.pdf; Author: CERN DEM JLC; CreateDate: 3/12/2007; LatestRevisionDate: 17/10/2012
R113 R114 = R0402_0R_JUMPER: Resistor - 1%; Part Description: 1A (0.05R Max DC Resistance) Zero Ohm Jumper; Manufacturer: GENERIC; Manufacturer1 Part Number: 232270591001; Table: Resistors SMD; Part Number: R0402_0R_JUMPER; Component Kind: Standard; Component Type: Standard; Pin Count: 2; Value: 0; Status: Not recommended; Manufacturer Part Number: R0402_0R_JUMPER; Case: 0402; Mounted: Yes; Socket: No; SMD: Yes; Manufacturer1 Example: PHYCOMP; Manufacturer1 ComponentHeight: 0.4mm; HelpURL: \\cern.ch\dfs\Applications\Altium\Datasheets\R0402_Phycomp_RC0402.pdf; Author: CERN DEM JLC; CreateDate: 2007-12-03; LatestRevisionDate: 2008-03-13

## Sheet FMC connector.SchDoc: Shuttler
size 420 x 297 mm; Author: G.Kasprowicz; CompanyName: WUT ISE; DrawnBy: G.Kasprowicz; Organization: WUT ISE; Address1: PW ISE; Address2: Nowowiejska 15/19 00-665 Warsaw; Address3: gkasprow@gmail.com; DocumentNumber: 7; Revision: 1.2; SheetNumber: 7; SheetTotal: 10; ModifiedBy: -; CheckedDate: -; Title2: FMC HPC connector; DivGrp: WUT ISE; Designer: G.Kasprowicz; ModifiedDate: -; ProjectName: Sensor Box
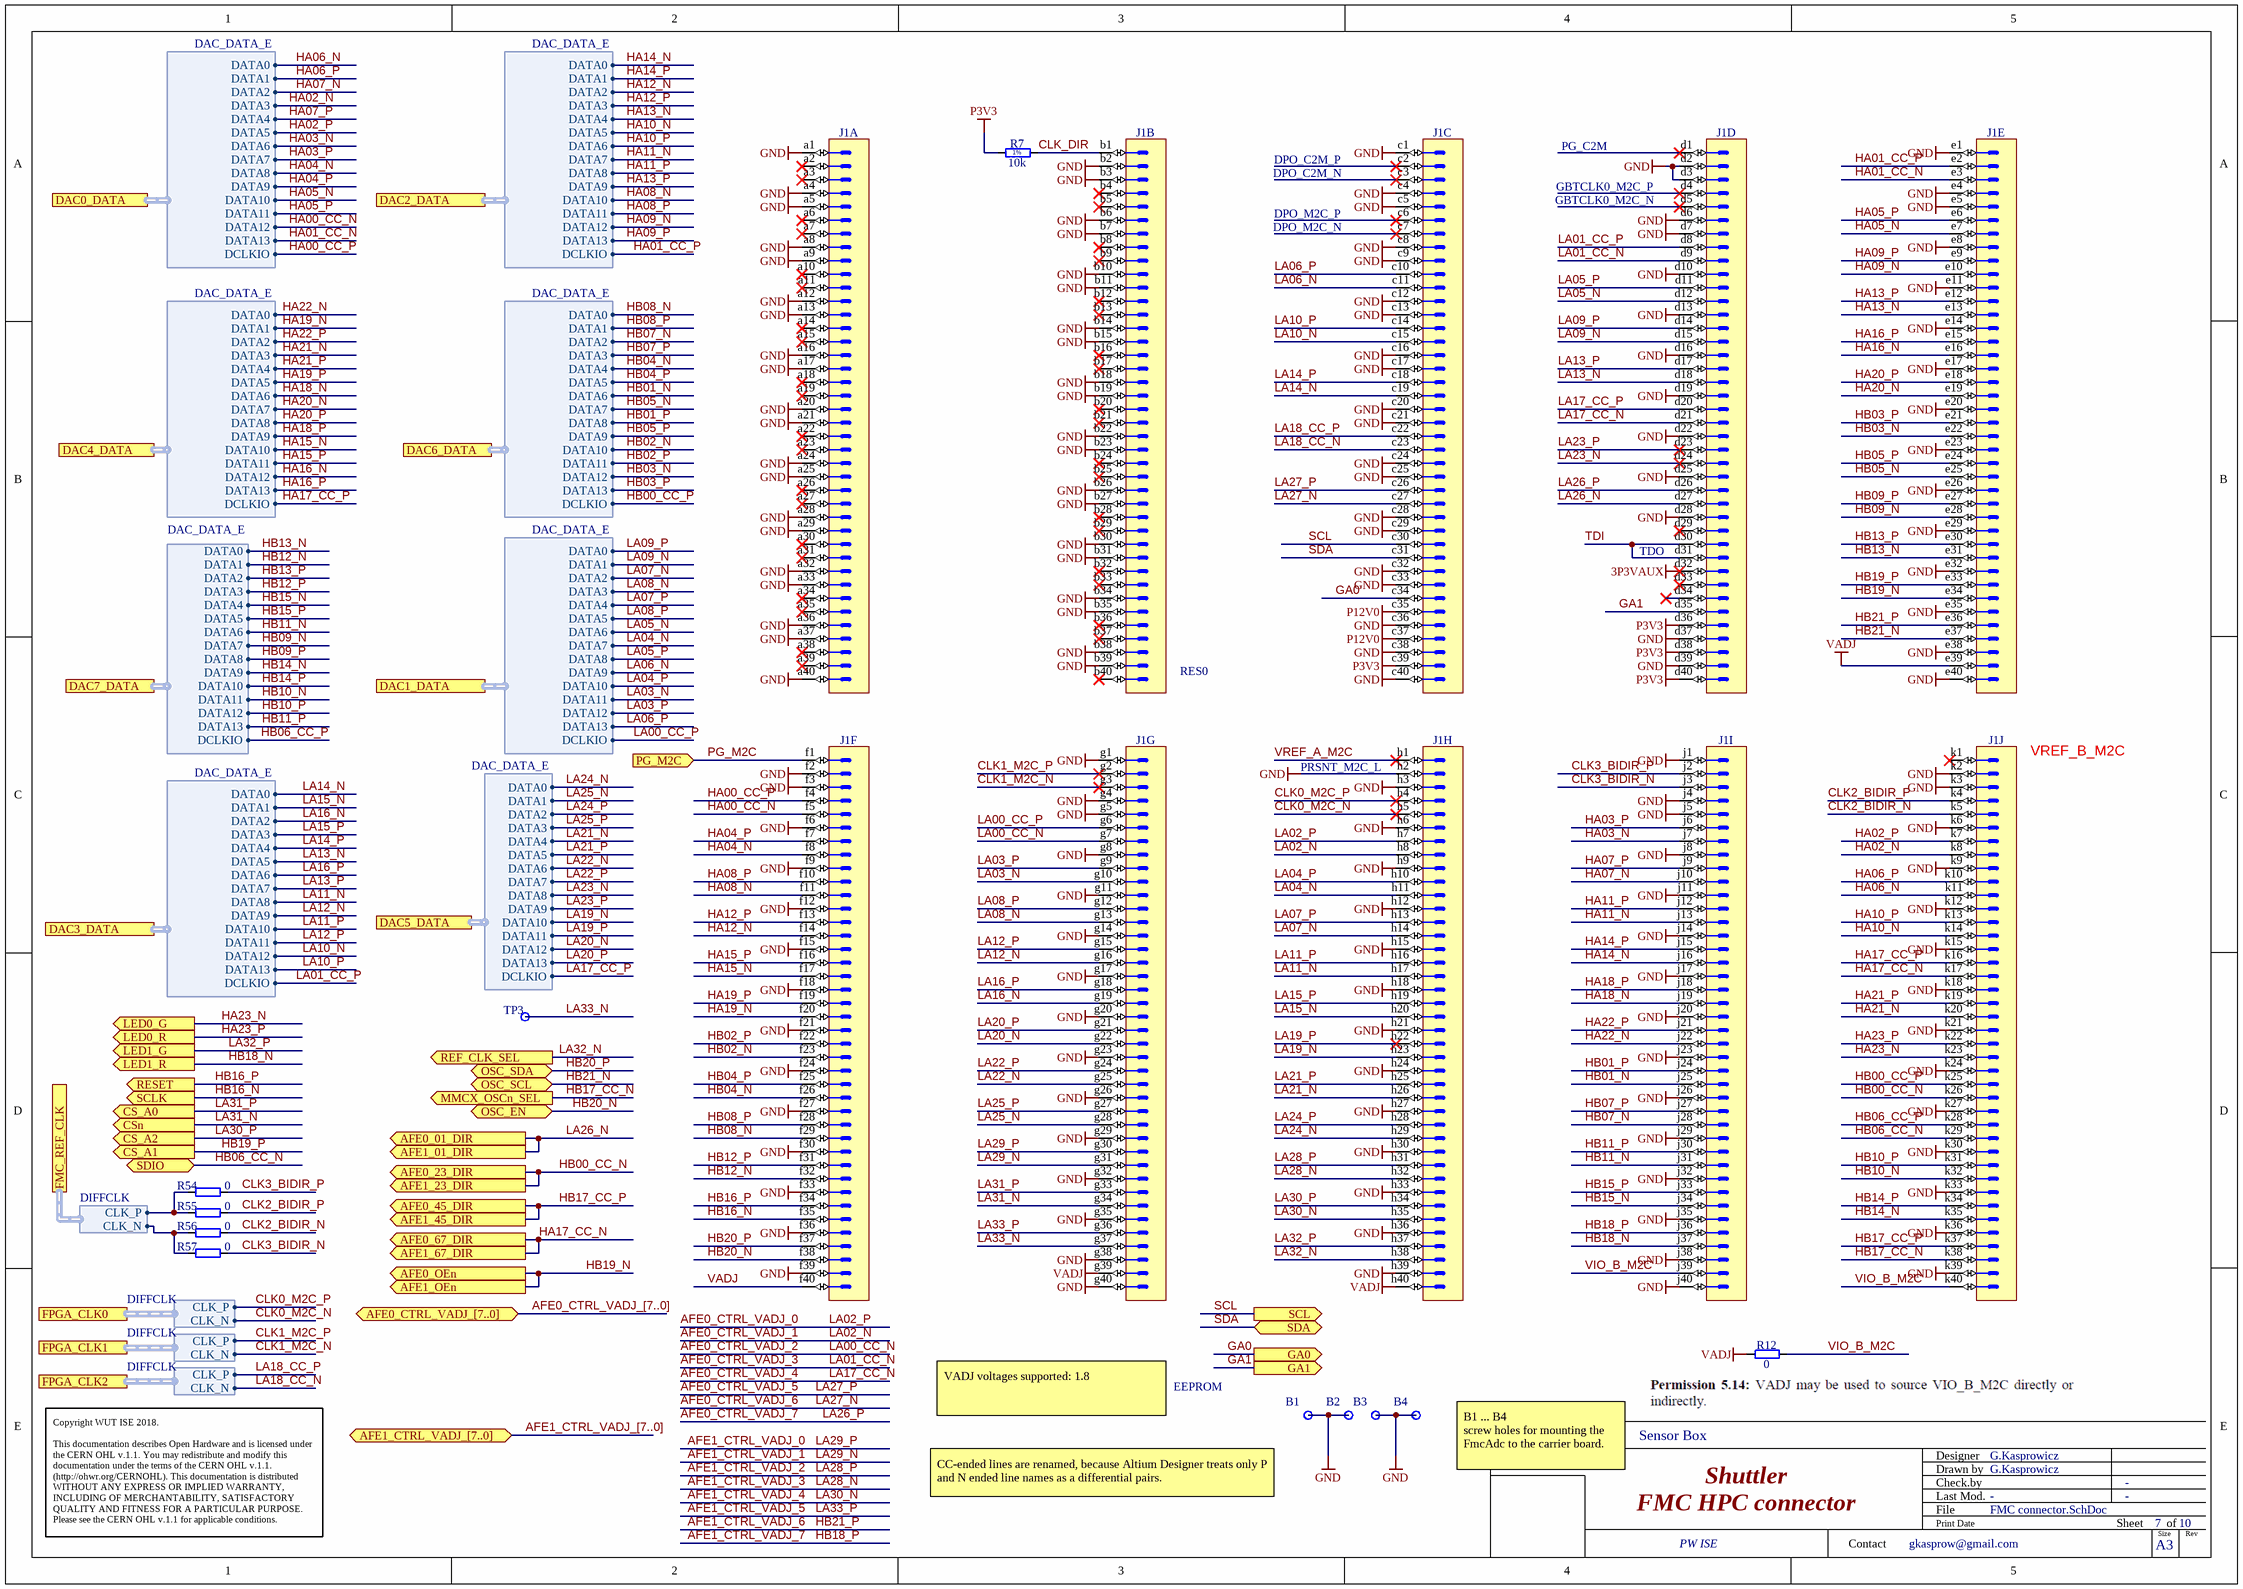
[diagram p2: FMC connector.SchDoc]

### Parts
(Parts that share a designator on the sheet are numbered #1, #2 ... from top to bottom, then left to right.)
B1  Plated Hole  [MTG300_600]  (value not drawn)
B2  Plated Hole  [MTG300_600]  (value not drawn)
B3  Plated Hole  [MTG300_600]  (value not drawn)
B4  Plated Hole  [MTG300_600]  (value not drawn)
J1  VITA 57  [SAMTEC_ASP-134488-01]  (value not drawn)  (parts A,B,C,D,E,F,G,H,I,J of 10)
R7  10k  [RESC1005X40N]
R12#1  0  [RESC1608X55N]
R54  0  [RESC1005X40N]
R55  0  [RESC1005X40N]
R56  0  [RESC1005X40N]
R57  0  [RESC1005X40N]
TP3  Test Point  [TPS127]  (value not drawn)  (no BOM)

### Ports
AFE0_01_DIR (out), AFE0_23_DIR (out), AFE0_45_DIR (out), AFE0_67_DIR (out), AFE0_CTRL_VADJ_[7..0] (bidir), AFE0_OEn (out), AFE1_01_DIR (out), AFE1_23_DIR (out), AFE1_45_DIR (out), AFE1_67_DIR (out), AFE1_CTRL_VADJ_[7..0] (bidir), AFE1_OEn (out), CS_A0 (out), CS_A1 (out), CS_A2 (out), CSn (out), DAC0_DATA (harness DAC_DATA_E), DAC1_DATA (harness DAC_DATA_E), DAC2_DATA (harness DAC_DATA_E), DAC3_DATA (harness DAC_DATA_E), DAC4_DATA (harness DAC_DATA_E), DAC5_DATA (harness DAC_DATA_E), DAC6_DATA (harness DAC_DATA_E), DAC7_DATA (harness DAC_DATA_E), FMC_REF_CLK (harness DIFFCLK), FPGA_CLK0 (harness DIFFCLK), FPGA_CLK1 (harness DIFFCLK), FPGA_CLK2 (harness DIFFCLK), GA0 (out), GA1 (out), LED0_G (out), LED0_R (out), LED1_G (out), LED1_R (out), MMCX_OSCn_SEL (out), OSC_EN (bidir), OSC_SCL (bidir), OSC_SDA (bidir), PG_M2C (in), REF_CLK_SEL (out), RESET (out), SCL (out), SCLK (out), SDA (bidir), SDIO (bidir)

### Harnesses
DAC_DATA_E: DATA0, DATA1, DATA2, DATA3, DATA4, DATA5, DATA6, DATA7, DATA8, DATA9, DATA10, DATA11, DATA12, DATA13, DCLKIO
DIFFCLK: CLK_P, CLK_N

### Nets
3P3VAUX: J1.d32
GND: B1.1 B2.1 B3.1 B4.1 J1.a1 J1.a4 J1.a5 J1.a8 J1.a9 J1.a12 J1.a13 J1.a16 J1.a17 J1.a20 J1.a21 J1.a24 J1.a25 J1.a28 J1.a29 J1.a32 J1.a33 J1.a36 J1.a37 J1.a40 J1.b2 J1.b3 J1.b6 J1.b7 J1.b10 J1.b11 J1.b14 J1.b15 J1.b18 J1.b19 J1.b22 J1.b23 J1.b26 J1.b27 J1.b30 J1.b31 J1.b34 J1.b35 J1.b38 J1.b39 J1.c1 J1.c4 J1.c5 J1.c8 J1.c9 J1.c12 J1.c13 J1.c16 J1.c17 J1.c20 J1.c21 J1.c24 J1.c25 J1.c28 J1.c29 J1.c32 J1.c33 J1.c36 J1.c38 J1.c40 J1.d2 J1.d3 J1.d6 J1.d7 J1.d10 J1.d13 J1.d16 J1.d19 J1.d22 J1.d25 J1.d28 J1.d37 J1.d39 J1.e1 J1.e4 J1.e5 J1.e8 J1.e11 J1.e14 J1.e17 J1.e20 J1.e23 J1.e26 J1.e29 J1.e32 J1.e35 J1.e38 J1.e40 J1.f2 J1.f3 J1.f6 J1.f9 J1.f12 J1.f15 J1.f18 J1.f21 J1.f24 J1.f27 J1.f30 J1.f33 J1.f36 J1.f39 J1.g1 J1.g4 J1.g5 J1.g8 J1.g11 J1.g14 J1.g17 J1.g20 J1.g23 J1.g26 J1.g29 J1.g32 J1.g35 J1.g38 J1.g40 J1.h2 J1.h3 J1.h6 J1.h9 J1.h12 J1.h15 J1.h18 J1.h21 J1.h24 J1.h27 J1.h30 J1.h33 J1.h36 J1.h39 J1.j1 J1.j4 J1.j5 J1.j8 J1.j11 J1.j14 J1.j17 J1.j20 J1.j23 J1.j26 J1.j29 J1.j32 J1.j35 J1.j38 J1.j40 J1.k2 J1.k3 J1.k6 J1.k9 J1.k12 J1.k15 J1.k18 J1.k21 J1.k24 J1.k27 J1.k30 J1.k33 J1.k36 J1.k39
P3V3: J1.c39 J1.d36 J1.d38 J1.d40 R7.1
P12V0: J1.c35 J1.c37
VADJ: J1.e39 J1.f40 J1.g39 J1.h40 R12#1.1
AFE0_CTRL_VADJ_0: J1.h7  [also labelled LA02_P]
AFE0_CTRL_VADJ_1: J1.h8  [also labelled LA02_N]
AFE0_CTRL_VADJ_2: J1.g7  [also labelled LA00_CC_N]
AFE0_CTRL_VADJ_3: J1.d9  [also labelled LA01_CC_N]
AFE0_CTRL_VADJ_4: J1.d21  [also labelled LA17_CC_N]
AFE0_CTRL_VADJ_5: J1.c26  [also labelled LA27_P]
AFE0_CTRL_VADJ_6: J1.c27  [also labelled LA27_N]
AFE0_CTRL_VADJ_7: J1.d26  [also labelled LA26_P]
AFE1_CTRL_VADJ_0: J1.g30  [also labelled LA29_P]
AFE1_CTRL_VADJ_1: J1.g31  [also labelled LA29_N]
AFE1_CTRL_VADJ_2: J1.h31  [also labelled LA28_P]
AFE1_CTRL_VADJ_3: J1.h32  [also labelled LA28_N]
AFE1_CTRL_VADJ_4: J1.h35  [also labelled LA30_N]
AFE1_CTRL_VADJ_5: J1.g36  [also labelled LA33_P]
AFE1_CTRL_VADJ_6: J1.e36  [also labelled HB21_P]
AFE1_CTRL_VADJ_7: J1.j36  [also labelled HB18_P]
CLK0_M2C_N: J1.h5 ; port FPGA_CLK0.CLK_N
CLK0_M2C_P: J1.h4 ; port FPGA_CLK0.CLK_P
CLK1_M2C_N: J1.g3 ; port FPGA_CLK1.CLK_N
CLK1_M2C_P: J1.g2 ; port FPGA_CLK1.CLK_P
CLK2_BIDIR_N: J1.k5 R56.2
CLK2_BIDIR_P: J1.k4 R55.2
CLK3_BIDIR_N: J1.j3 R57.2
CLK3_BIDIR_P: J1.j2 R54.2
CLK_DIR: J1.b1 R7.2
GA0: J1.c34 ; port GA0
GA1: J1.d35 ; port GA1
HA00_CC_N: J1.f5 ; port DAC0_DATA.DATA12  [project net DATA12]
HA00_CC_P: J1.f4 ; port DAC0_DATA.DCLKIO  [project net DCLKIO]
HA01_CC_N: J1.e3 ; port DAC0_DATA.DATA13  [project net DATA13]
HA01_CC_P: J1.e2 ; port DAC2_DATA.DCLKIO  [project net DCLKIO]
HA02_N: J1.k8 ; port DAC0_DATA.DATA3  [project net DATA3]
HA02_P: J1.k7 ; port DAC0_DATA.DATA5  [project net DATA5]
HA03_N: J1.j7 ; port DAC0_DATA.DATA6  [project net DATA6]
HA03_P: J1.j6 ; port DAC0_DATA.DATA7  [project net DATA7]
HA04_N: J1.f8 ; port DAC0_DATA.DATA8  [project net DATA8]
HA04_P: J1.f7 ; port DAC0_DATA.DATA9  [project net DATA9]
HA05_N: J1.e7 ; port DAC0_DATA.DATA10  [project net DATA10]
HA05_P: J1.e6 ; port DAC0_DATA.DATA11  [project net DATA11]
HA06_N: J1.k11 ; port DAC0_DATA.DATA0  [project net DATA0]
HA06_P: J1.k10 ; port DAC0_DATA.DATA1  [project net DATA1]
HA07_N: J1.j10 ; port DAC0_DATA.DATA2  [project net DATA2]
HA07_P: J1.j9 ; port DAC0_DATA.DATA4  [project net DATA4]
HA08_N: J1.f11 ; port DAC2_DATA.DATA10  [project net DATA10]
HA08_P: J1.f10 ; port DAC2_DATA.DATA11  [project net DATA11]
HA09_N: J1.e10 ; port DAC2_DATA.DATA12  [project net DATA12]
HA09_P: J1.e9 ; port DAC2_DATA.DATA13  [project net DATA13]
HA10_N: J1.k14 ; port DAC2_DATA.DATA5  [project net DATA5]
HA10_P: J1.k13 ; port DAC2_DATA.DATA6  [project net DATA6]
HA11_N: J1.j13 ; port DAC2_DATA.DATA7  [project net DATA7]
HA11_P: J1.j12 ; port DAC2_DATA.DATA8  [project net DATA8]
HA12_N: J1.f14 ; port DAC2_DATA.DATA2  [project net DATA2]
HA12_P: J1.f13 ; port DAC2_DATA.DATA3  [project net DATA3]
HA13_N: J1.e13 ; port DAC2_DATA.DATA4  [project net DATA4]
HA13_P: J1.e12 ; port DAC2_DATA.DATA9  [project net DATA9]
HA14_N: J1.j16 ; port DAC2_DATA.DATA0  [project net DATA0]
HA14_P: J1.j15 ; port DAC2_DATA.DATA1  [project net DATA1]
HA15_N: J1.f17 ; port DAC4_DATA.DATA10  [project net DATA10]
HA15_P: J1.f16 ; port DAC4_DATA.DATA11  [project net DATA11]
HA16_N: J1.e16 ; port DAC4_DATA.DATA12  [project net DATA12]
HA16_P: J1.e15 ; port DAC4_DATA.DATA13  [project net DATA13]
HA17_CC_N: J1.k17 ; port AFE0_67_DIR, port AFE1_67_DIR
HA17_CC_P: J1.k16 ; port DAC4_DATA.DCLKIO  [project net DCLKIO]
HA18_N: J1.j19 ; port DAC4_DATA.DATA6  [project net DATA6]
HA18_P: J1.j18 ; port DAC4_DATA.DATA9  [project net DATA9]
HA19_N: J1.f20 ; port DAC4_DATA.DATA1  [project net DATA1]
HA19_P: J1.f19 ; port DAC4_DATA.DATA5  [project net DATA5]
HA20_N: J1.e19 ; port DAC4_DATA.DATA7  [project net DATA7]
HA20_P: J1.e18 ; port DAC4_DATA.DATA8  [project net DATA8]
HA21_N: J1.k20 ; port DAC4_DATA.DATA3  [project net DATA3]
HA21_P: J1.k19 ; port DAC4_DATA.DATA4  [project net DATA4]
HA22_N: J1.j22 ; port DAC4_DATA.DATA0  [project net DATA0]
HA22_P: J1.j21 ; port DAC4_DATA.DATA2  [project net DATA2]
HA23_N: J1.k23 ; port LED0_G
HA23_P: J1.k22 ; port LED0_R
HB00_CC_N: J1.k26 ; port AFE0_23_DIR, port AFE1_23_DIR
HB00_CC_P: J1.k25 ; port DAC6_DATA.DCLKIO  [project net DCLKIO]
HB01_N: J1.j25 ; port DAC6_DATA.DATA6  [project net DATA6]
HB01_P: J1.j24 ; port DAC6_DATA.DATA8  [project net DATA8]
HB02_N: J1.f23 ; port DAC6_DATA.DATA10  [project net DATA10]
HB02_P: J1.f22 ; port DAC6_DATA.DATA11  [project net DATA11]
HB03_N: J1.e22 ; port DAC6_DATA.DATA12  [project net DATA12]
HB03_P: J1.e21 ; port DAC6_DATA.DATA13  [project net DATA13]
HB04_N: J1.f26 ; port DAC6_DATA.DATA4  [project net DATA4]
HB04_P: J1.f25 ; port DAC6_DATA.DATA5  [project net DATA5]
HB05_N: J1.e25 ; port DAC6_DATA.DATA7  [project net DATA7]
HB05_P: J1.e24 ; port DAC6_DATA.DATA9  [project net DATA9]
HB06_CC_N: J1.k29 ; port SDIO
HB06_CC_P: J1.k28 ; port DAC7_DATA.DCLKIO  [project net DCLKIO]
HB07_N: J1.j28 ; port DAC6_DATA.DATA2  [project net DATA2]
HB07_P: J1.j27 ; port DAC6_DATA.DATA3  [project net DATA3]
HB08_N: J1.f29 ; port DAC6_DATA.DATA0  [project net DATA0]
HB08_P: J1.f28 ; port DAC6_DATA.DATA1  [project net DATA1]
HB09_N: J1.e28 ; port DAC7_DATA.DATA7  [project net DATA7]
HB09_P: J1.e27 ; port DAC7_DATA.DATA8  [project net DATA8]
HB10_N: J1.k32 ; port DAC7_DATA.DATA11  [project net DATA11]
HB10_P: J1.k31 ; port DAC7_DATA.DATA12  [project net DATA12]
HB11_N: J1.j31 ; port DAC7_DATA.DATA6  [project net DATA6]
HB11_P: J1.j30 ; port DAC7_DATA.DATA13  [project net DATA13]
HB12_N: J1.f32 ; port DAC7_DATA.DATA1  [project net DATA1]
HB12_P: J1.f31 ; port DAC7_DATA.DATA3  [project net DATA3]
HB13_N: J1.e31 ; port DAC7_DATA.DATA0  [project net DATA0]
HB13_P: J1.e30 ; port DAC7_DATA.DATA2  [project net DATA2]
HB14_N: J1.k35 ; port DAC7_DATA.DATA9  [project net DATA9]
HB14_P: J1.k34 ; port DAC7_DATA.DATA10  [project net DATA10]
HB15_N: J1.j34 ; port DAC7_DATA.DATA4  [project net DATA4]
HB15_P: J1.j33 ; port DAC7_DATA.DATA5  [project net DATA5]
HB16_N: J1.f35 ; port SCLK
HB16_P: J1.f34 ; port RESET
HB17_CC_N: J1.k38 ; port MMCX_OSCn_SEL
HB17_CC_P: J1.k37 ; port AFE1_45_DIR, port AFE0_45_DIR
HB18_N: J1.j37 ; port LED1_R
HB19_N: J1.e34 ; port AFE1_OEn, port AFE0_OEn
HB19_P: J1.e33 ; port CS_A1  [project net CS_A1]
HB20_N: J1.f38 ; port OSC_EN
HB20_P: J1.f37 ; port OSC_SDA
HB21_N: J1.e37 ; port OSC_SCL
LA00_CC_P: J1.g6 ; port DAC1_DATA.DCLKIO  [project net DCLKIO]
LA01_CC_P: J1.d8 ; port DAC3_DATA.DCLKIO  [project net DCLKIO]
LA03_N: J1.g10 ; port DAC1_DATA.DATA11  [project net DATA11]
LA03_P: J1.g9 ; port DAC1_DATA.DATA12  [project net DATA12]
LA04_N: J1.h11 ; port DAC1_DATA.DATA7  [project net DATA7]
LA04_P: J1.h10 ; port DAC1_DATA.DATA10  [project net DATA10]
LA05_N: J1.d12 ; port DAC1_DATA.DATA6  [project net DATA6]
LA05_P: J1.d11 ; port DAC1_DATA.DATA8  [project net DATA8]
LA06_N: J1.c11 ; port DAC1_DATA.DATA9  [project net DATA9]
LA06_P: J1.c10 ; port DAC1_DATA.DATA13  [project net DATA13]
LA07_N: J1.h14 ; port DAC1_DATA.DATA2  [project net DATA2]
LA07_P: J1.h13 ; port DAC1_DATA.DATA4  [project net DATA4]
LA08_N: J1.g13 ; port DAC1_DATA.DATA3  [project net DATA3]
LA08_P: J1.g12 ; port DAC1_DATA.DATA5  [project net DATA5]
LA09_N: J1.d15 ; port DAC1_DATA.DATA1  [project net DATA1]
LA09_P: J1.d14 ; port DAC1_DATA.DATA0  [project net DATA0]
LA10_N: J1.c15 ; port DAC3_DATA.DATA12  [project net DATA12]
LA10_P: J1.c14 ; port DAC3_DATA.DATA13  [project net DATA13]
LA11_N: J1.h17 ; port DAC3_DATA.DATA8  [project net DATA8]
LA11_P: J1.h16 ; port DAC3_DATA.DATA10  [project net DATA10]
LA12_N: J1.g16 ; port DAC3_DATA.DATA9  [project net DATA9]
LA12_P: J1.g15 ; port DAC3_DATA.DATA11  [project net DATA11]
LA13_N: J1.d18 ; port DAC3_DATA.DATA5  [project net DATA5]
LA13_P: J1.d17 ; port DAC3_DATA.DATA7  [project net DATA7]
LA14_N: J1.c19 ; port DAC3_DATA.DATA0  [project net DATA0]
LA14_P: J1.c18 ; port DAC3_DATA.DATA4  [project net DATA4]
LA15_N: J1.h20 ; port DAC3_DATA.DATA1  [project net DATA1]
LA15_P: J1.h19 ; port DAC3_DATA.DATA3  [project net DATA3]
LA16_N: J1.g19 ; port DAC3_DATA.DATA2  [project net DATA2]
LA16_P: J1.g18 ; port DAC3_DATA.DATA6  [project net DATA6]
LA17_CC_P: J1.d20 ; port DAC5_DATA.DCLKIO  [project net DCLKIO]
LA18_CC_N: J1.c23 ; port FPGA_CLK2.CLK_N  [project net FPGA_CLK2_N]
LA18_CC_P: J1.c22 ; port FPGA_CLK2.CLK_P  [project net FPGA_CLK2_P]
LA19_N: J1.h23 ; port DAC5_DATA.DATA10  [project net DATA10]
LA19_P: J1.h22 ; port DAC5_DATA.DATA11  [project net DATA11]
LA20_N: J1.g22 ; port DAC5_DATA.DATA12  [project net DATA12]
LA20_P: J1.g21 ; port DAC5_DATA.DATA13  [project net DATA13]
LA21_N: J1.h26 ; port DAC5_DATA.DATA4  [project net DATA4]
LA21_P: J1.h25 ; port DAC5_DATA.DATA5  [project net DATA5]
LA22_N: J1.g25 ; port DAC5_DATA.DATA6  [project net DATA6]
LA22_P: J1.g24 ; port DAC5_DATA.DATA7  [project net DATA7]
LA23_N: J1.d24 ; port DAC5_DATA.DATA8  [project net DATA8]
LA23_P: J1.d23 ; port DAC5_DATA.DATA9  [project net DATA9]
LA24_N: J1.h29 ; port DAC5_DATA.DATA0  [project net DATA0]
LA24_P: J1.h28 ; port DAC5_DATA.DATA2  [project net DATA2]
LA25_N: J1.g28 ; port DAC5_DATA.DATA1  [project net DATA1]
LA25_P: J1.g27 ; port DAC5_DATA.DATA3  [project net DATA3]
LA26_N: J1.d27 ; port AFE1_01_DIR, port AFE0_01_DIR
LA30_P: J1.h34 ; port CS_A2  [project net CS_A2]
LA31_N: J1.g34 ; port CSn  [project net CSn]
LA31_P: J1.g33 ; port CS_A0  [project net CS_A0]
LA32_N: J1.h38 ; port REF_CLK_SEL
LA32_P: J1.h37 ; port LED1_G
LA33_N: J1.g37 TP3.1
PG_M2C: J1.f1 ; port PG_M2C
REFA_N: R56.1 R57.1 ; port FMC_REF_CLK.CLK_N
REFA_P: R54.1 R55.1 ; port FMC_REF_CLK.CLK_P
SCL: J1.c30 ; port SCL
SDA: J1.c31 ; port SDA
TDI: J1.d30 J1.d31
VIO_B_M2C: J1.j39 J1.k40 R12#1.2
VREF_A_M2C: J1.h1

Not connected (* = marked no-connect by the designer): J1 a2* a3* a6* a7* a10* a11* a14* a15* a18* a19* a22* a23* a26* a27* a30* a31* a34* a35* a38* a39* b4* b5* b8* b9* b12* b13* b16* b17* b20* b21* b24* b25* b28* b29* b32* b33* b36* b37* b40* c2* c3* c6* c7* d1* d4* d5* d29* d33* d34* k1*

### Buses and harness runs
bus AFE0_CTRL_VADJ_[7..0] = port AFE0_CTRL_VADJ_[7..0]
bus AFE1_CTRL_VADJ_[7..0] = port AFE1_CTRL_VADJ_[7..0]

### Notes on the sheet
- DPO_C2M_P
- DPO_C2M_N
- PG_C2M
- GBTCLK0_M2C_P
- DPO_M2C_P
- DPO_M2C_N
- GBTCLK0_M2C_N
- (near J1) TDO
- RES0
- (near J1) PRSNT_M2C_L
- VREF_B_M2C
- EEPROM
- VADJ voltages supported: 1.8
- (near B4) B1 ... B4
  screw holes for mounting the FmcAdc to the carrier board.
- (near B1) CC-ended lines are renamed, because Altium Designer treats only P and N ended line names as a differential pairs.
- Project/Equipment
- Document
- Designer
- Drawn by
- Check.by
- Copyright WUT ISE 2018.
  This documentation describes Open Hardware and is licensed under the CERN OHL v.1.1. You may redistribute and modify this documentation under the terms of the CERN OHL v.1.1. (http://ohwr.org/CERNOHL). This documentation is distributed WITHOUT ANY EXPRESS OR IMPLIED WARRANTY, INCLUDING OF MERCHANTABILITY, SATISFACTORY QUALITY AND FITNESS FOR A PARTICULAR PURPOSE. Please see the CERN OHL v.1.1 for applicable conditions.
- Contact
- File
- Last Mod.
- Print Date
- Sheet
- Size
- A3
- of
- Rev
- (in symbol R0402_10K_1%_0.0625W_100PPM) 1%

### Library data of the parts
B1-B4 = PLATED_HOLE3.0_PAD6.0: Single Terminal Socket; Part Description: Plated Through Hole: Hole Dia.=3.0mm Pad Dia.=6.0mm; Mounted: No; Table: Pads; Part Number: PLATED_HOLE3.0_PAD6.0; Component Kind: Standard (No BOM); Component Type: Standard (No BOM); Designator: Single Terminal Socket; Library Reference: Single Terminal Socket; Pin Count: 1; Family: Plated Hole; Socket: No; SMD: No; Status: None; ComponentHeight: 0mm; Author: CERN DEM JLC; CreateDate: 26.05.2008; LatestRevisionDate: 26.05.2008; PackageDescription: Plated Through Hole: Hole Dia.=3.0mm Pad Dia.=6.0mm
J1 = SAMTEC_ASP-134488-01: Connector VITA 57, 400 Male contacts in 10 row abcdefghj; Part Description: 400 contacts (10 rows abcdefghj) Surface Mount Male Connector, VITA 57 (MC-HPC-10); Manufacturer: SAMTEC; Part Number: SAMTEC_ASP-134488-01; Component Kind: Standard; Component Type: Standard; Pin Count: 400; Family: VITA 57; Mounted: Yes; Socket: No; SMD: Yes; Status: None; Manufacturer Part Number: ASP-134488-01; ComponentHeight: 6.1mm; HelpURL: \\cern.ch\dfs\Applications\Altium\Datasheets\SAMTEC_ASP-134488-01.pdf; Author: CERN DEM JLC; CreateDate: 30/04/2009; LatestRevisionDate: 17/08/2009; Table: SAMTEC
R7 = R0402_10K_1%_0.0625W_100PPM: as R105 on sheet EEPROM_Temp; Part Number: R0402_10K_1%_0.0625W_100PPM; Component Kind: Standard; Component Type: Standard; Pin Count: 2; Value: 10k; Status: Not recommended; Power: 0.0625W; Tolerance: ±1%; Manufacturer Part Number: R0402_10K_1%_0.0625W_100PPM; Case: 0402; Mounted: Yes; Socket: No; SMD: Yes; Manufacturer1 Example: YAGEO PHYCOMP; Manufacturer1 ComponentHeight: 0.4mm; HelpURL: \\cern.ch\dfs\Applications\Altium\Datasheets\R0402_Phycomp_RC0402.pdf; Author: CERN DEM JLC; CreateDate: 2007-12-03; LatestRevisionDate: 2012-10-17
R12#1 = R0603_0R_JUMPER: Resistor; Part Description: 1A (0.05R Max DC Resistance) Zero Ohm Jumper; Manufacturer: GENERIC; Manufacturer1 Part Number: NRC06Z0; PressFit: No; Part Number: R0603_0R_JUMPER; Component Kind: Standard; Component Type: Standard; Pin Count: 2; Value: 0; Status: Preferred; Manufacturer Part Number: R0603_0R_JUMPER; Case: 0603; Mounted: Yes; Sense: No; Socket: No; SMD: Yes; Manufacturer1 Example: NIC COMPONENT; Manufacturer1 ComponentHeight: 0.55mm; HelpURL: \\cern.ch\dfs\Applications\Altium\Datasheets\R0603_NIC_NRC.pdf; Author: CERN DEM JLC; CreateDate: 03.12.2007; LatestRevisionDate: 13.03.2008
R54-R57 = R0402_0R_JUMPER: Resistor; Part Description: 1A (0.05R Max DC Resistance) Zero Ohm Jumper; Manufacturer: GENERIC; Manufacturer1 Part Number: 232270591001L; PressFit: No; Part Number: R0402_0R_JUMPER; Component Kind: Standard; Component Type: Standard; Pin Count: 2; Value: 0; Status: Not Recommended; Manufacturer Part Number: R0402_0R_JUMPER; Case: 0402; Mounted: Yes; Sense: No; Socket: No; SMD: Yes; Manufacturer1 Example: YAGEO PHYCOMP; Manufacturer1 ComponentHeight: 0.4mm; HelpURL: \\cern.ch\dfs\Applications\Altium\Datasheets\R0402_Phycomp_RC0402.pdf; Author: CERN DEM JLC; CreateDate: 03/12/2007; LatestRevisionDate: 17/10/2012
TP3 = SMD_PAD_1.27X1.27MM: as TP4 on sheet FMC_DAC_125M_14B_16CHA; Part Number: SMD_PAD_1.27X1.27MM; Component Type: Standard (No BOM); Pin Count: 1; Family: Test Point; Socket: No; SMD: Yes; Sense: No; Status: None; ComponentHeight: 0mm; HelpURL: Undefined; Author: CERN DEM JLC; CreateDate: 12.01.2008; LatestRevisionDate: 12.01.2008; PackageDescription: 1.27mm x 1.27mm PCB Copper Area (SMD Test Point)